# EAGLE design X2C_DC_SHIELD (EAGLE 9.0.1)
X2C Low end DC motor shield

## Sheet 1 of 2
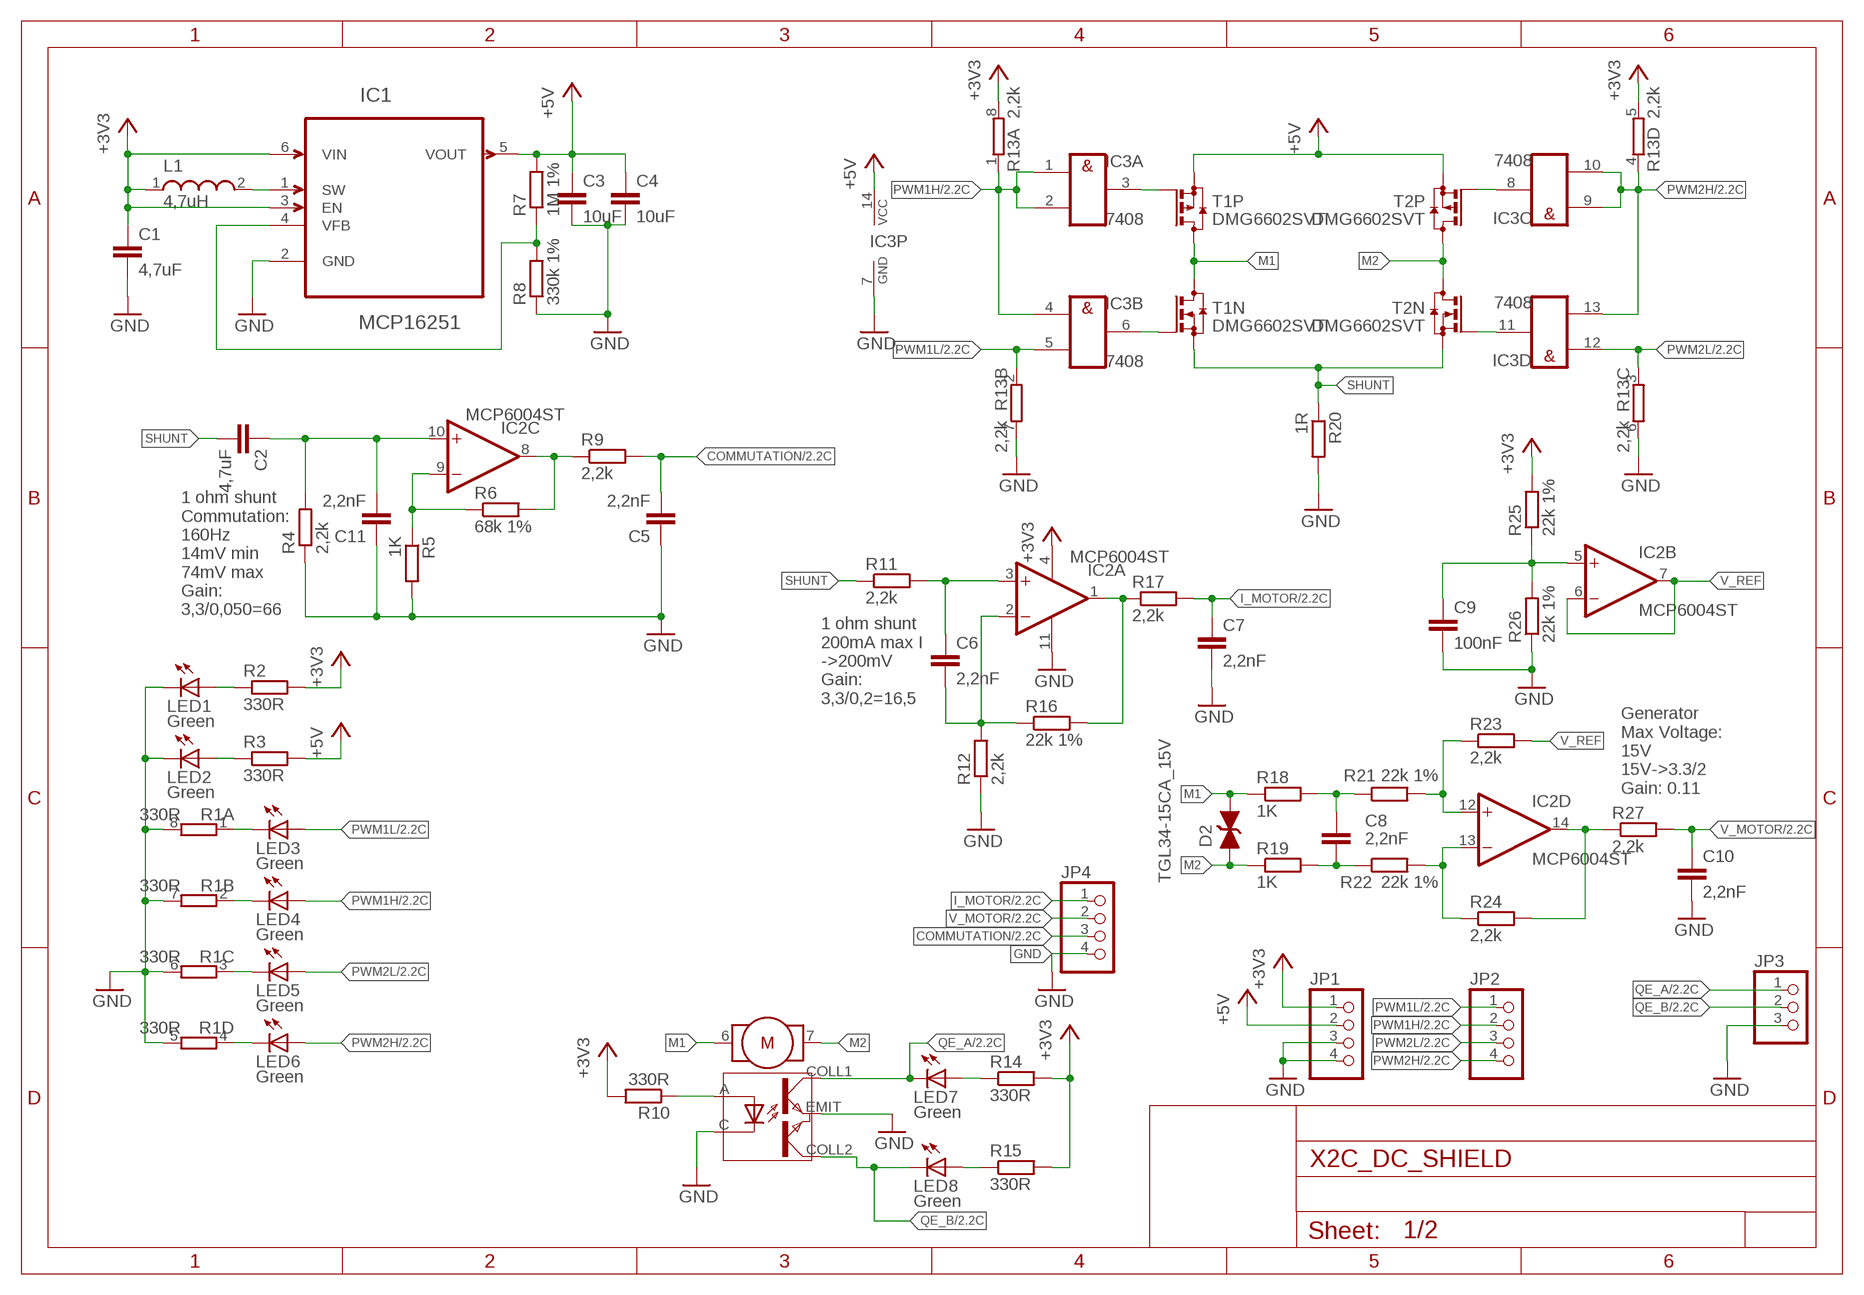
[diagram p0: schematic, sheet 1]

### Parts
C1  4,7uF  C-EU-SMD_0603_4,7UF_16V  [C0603K]
C2  4,7uF  C-EU-SMD_0603_4,7UF_16V  [C0603K]
C3  10uF  C-EU-SMD_0805_10UF_16V  [C0805K]
C4  10uF  C-EU-SMD_0805_10UF_16V  [C0805K]
C5  2,2nF  C-EU-SMD_0603_2,2NF  [C0603K]
C6  2,2nF  C-EU-SMD_0603_2,2NF  [C0603K]
C7  2,2nF  C-EU-SMD_0603_2,2NF  [C0603K]
C8  2,2nF  C-EU-SMD_0603_2,2NF  [C0603K]
C9  100nF  C-EU-SMD_0603_100NF_50V  [C0603K]
C10  2,2nF  C-EU-SMD_0603_2,2NF  [C0603K]
C11  2,2nF  C-EU-SMD_0603_2,2NF  [C0603K]
D2  TGL34-15CA_15V  TRANSIL_DUAL_DIODE  [DO213AA]
IC1  MCP16251  [SOT95P270X145-6N]
IC2  MCP6004ST  [TSSOP14]
IC3  7408  [TSSOP14]
JP1  PINHD-1X4  [1X04]
JP2  PINHD-1X4  [1X04]
JP3  PINHD-1X03_2.54  [1X03]
JP4  PINHD-1X4  [1X04]
L1  4,7uH  WE-TPC_3816_4,7UH_0,9A  [WE-TPC_3816]
LED1  Green  LEDCHIPLED_0805_GREEN  [CHIPLED_0805]
LED2  Green  LEDCHIPLED_0805_GREEN  [CHIPLED_0805]
LED3  Green  LEDCHIPLED_0805_GREEN  [CHIPLED_0805]
LED4  Green  LEDCHIPLED_0805_GREEN  [CHIPLED_0805]
LED5  Green  LEDCHIPLED_0805_GREEN  [CHIPLED_0805]
LED6  Green  LEDCHIPLED_0805_GREEN  [CHIPLED_0805]
LED7  Green  LEDCHIPLED_0805_GREEN  [CHIPLED_0805]
LED8  Green  LEDCHIPLED_0805_GREEN  [CHIPLED_0805]
MOT1  DC_MOT  DC_MOTOR_1  [DC_MOTOR]
R1  330R  4R-N330R  [EXBV8V_A]
R2  330R  R-EU_SMDR0603_330R  [R0603]
R3  330R  R-EU_SMDR0603_330R  [R0603]
R4  2,2k  R-EU_SMDR0603_2,2K  [R0603]
R5  1K  R-EU_SMDR0603_1K_1%  [R0603]
R6  68k 1%  R-EU_SMDR0603_68K_1%  [R0603]
R7  1M 1%  R-EU_SMDR0603_1M_1%  [R0603]
R8  330k 1%  R-EU_SMDR0603_330K_1%  [R0603]
R9  2,2k  R-EU_SMDR0603_2,2K  [R0603]
R10  330R  R-EU_SMDR0603_330R  [R0603]
R11  2,2k  R-EU_SMDR0603_2,2K  [R0603]
R12  2,2k  R-EU_SMDR0603_2,2K  [R0603]
R13  2,2k  4R-N2,2K  [EXBV8V_A]
R14  330R  R-EU_SMDR0603_330R  [R0603]
R15  330R  R-EU_SMDR0603_330R  [R0603]
R16  22k 1%  R-EU_SMDR0603_22K_1%  [R0603]
R17  2,2k  R-EU_SMDR0603_2,2K  [R0603]
R18  1K  R-EU_SMDR0603_1K_1%  [R0603]
R19  1K  R-EU_SMDR0603_1K_1%  [R0603]
R20  1R  R-EU_SMDR0805_1R_1%  [R0805]
R21  22k 1%  R-EU_SMDR0603_22K_1%  [R0603]
R22  22k 1%  R-EU_SMDR0603_22K_1%  [R0603]
R23  2,2k  R-EU_SMDR0603_2,2K  [R0603]
R24  2,2k  R-EU_SMDR0603_2,2K  [R0603]
R25  22k 1%  R-EU_SMDR0603_22K_1%  [R0603]
R26  22k 1%  R-EU_SMDR0603_22K_1%  [R0603]
R27  2,2k  R-EU_SMDR0603_2,2K  [R0603]
T1  DMG6602SVT  [TSOT23-6]
T2  DMG6602SVT  [TSOT23-6]

### Nets
+3V3: C1.1 IC1.3(EN) IC1.6(VIN) IC2.4(P:V+) JP1.1 L1.1 R2.2 R10.2 R13.5 R13.8 R14.2 R15.2 R25.2 ; also sheet 2
+5V: C3.1 C4.1 IC1.5(VOUT) IC3.14(P:VCC) JP1.2 R3.2 R7.2 T1.2(P:S) T2.2(P:S)
COMMUTATION: C5.2 JP4.3 R9.2 ; also sheet 2
GND: C1.2 C3.2 C4.2 C5.1 C7.2 C9.2 C10.2 C11.1 IC1.2(GND) IC2.11(P:V-) IC3.7(P:GND) JP1.3 JP1.4 JP3.3 JP4.4 LED1.C LED2.C MOT1.C MOT1.EMIT R1.5 R1.6 R1.7 R1.8 R4.1 R5.2 R8.1 R12.1 R13.6 R13.7 R20.2 R26.1 ; also sheet 2
I_MOTOR: C7.1 JP4.1 R17.2 ; also sheet 2
IMOTOR: IC2.1(A:OUT) R16.2 R17.1
M1: D2.C MOT1.6(MOT1) R18.1 T1.4(P:D) T1.6(N:D)
M2: D2.A MOT1.7(MOT2) R19.1 T2.4(P:D) T2.6(N:D)
N$1: IC3.8(C:O) T2.3(P:G)
N$2: IC3.6(B:O) T1.1(N:G)
N$3: IC3.3(A:O) T1.3(P:G)
N$4: IC1.1(SW) L1.2
N$5: C9.1 IC2.5(B:+IN) R25.1 R26.2
N$6: LED7.A R14.1
N$7: IC3.11(D:O) T2.1(N:G)
N$8: LED1.A R2.1
N$9: LED2.A R3.1
N$10: LED3.C R1.1
N$11: C6.2 IC2.2(A:-IN) R12.2 R16.1
N$12: IC1.4(VFB) R7.1 R8.2
N$13: LED4.C R1.2
N$14: LED5.C R1.3
N$15: LED6.C R1.4
N$16: LED8.A R15.1
N$18: IC2.12(D:+IN) R21.2 R23.1
N$19: C8.1 R18.2 R21.1
N$20: C8.2 R19.2 R22.1
N$21: IC2.13(D:-IN) R22.2 R24.1
N$22: C6.1 IC2.3(A:+IN) R11.2
N$23: IC2.8(C:OUT) R6.2 R9.1
N$24: IC2.9(C:-IN) R5.1 R6.1
N$25: IC2.14(D:OUT) R24.2 R27.1
N$26: C2.1 C11.2 IC2.10(C:+IN) R4.2
N$28: MOT1.A R10.1
PWM1H: IC3.1(A:I0) IC3.2(A:I1) IC3.4(B:I0) JP2.2 LED4.A R13.1 ; also sheet 2
PWM1L: IC3.5(B:I1) JP2.1 LED3.A R13.2 ; also sheet 2
PWM2H: IC3.9(C:I0) IC3.10(C:I1) IC3.13(D:I1) JP2.4 LED6.A R13.4 ; also sheet 2
PWM2L: IC3.12(D:I0) JP2.3 LED5.A R13.3 ; also sheet 2
QE_A: JP3.1 LED7.C MOT1.COLL1(COL1) ; also sheet 2
QE_B: JP3.2 LED8.C MOT1.COLL2(COL2) ; also sheet 2
SHUNT: C2.2 R11.1 R20.1 T1.5(N:S) T2.5(N:S)
V_MOTOR: C10.1 JP4.2 R27.2 ; also sheet 2
V_REF: IC2.6(B:-IN) IC2.7(B:OUT) R23.2

### Notes on the sheet
- 1 ohm shunt
  Commutation:
  160Hz
  14mV min
  74mV max
  Gain:
  3,3/0,050=66
- 1 ohm shunt
  200mA max I
  ->200mV
  Gain:
  3,3/0,2=16,5
- Generator
  Max Voltage:
  15V
  15V->3.3/2
  Gain: 0.11

## Sheet 2 of 2
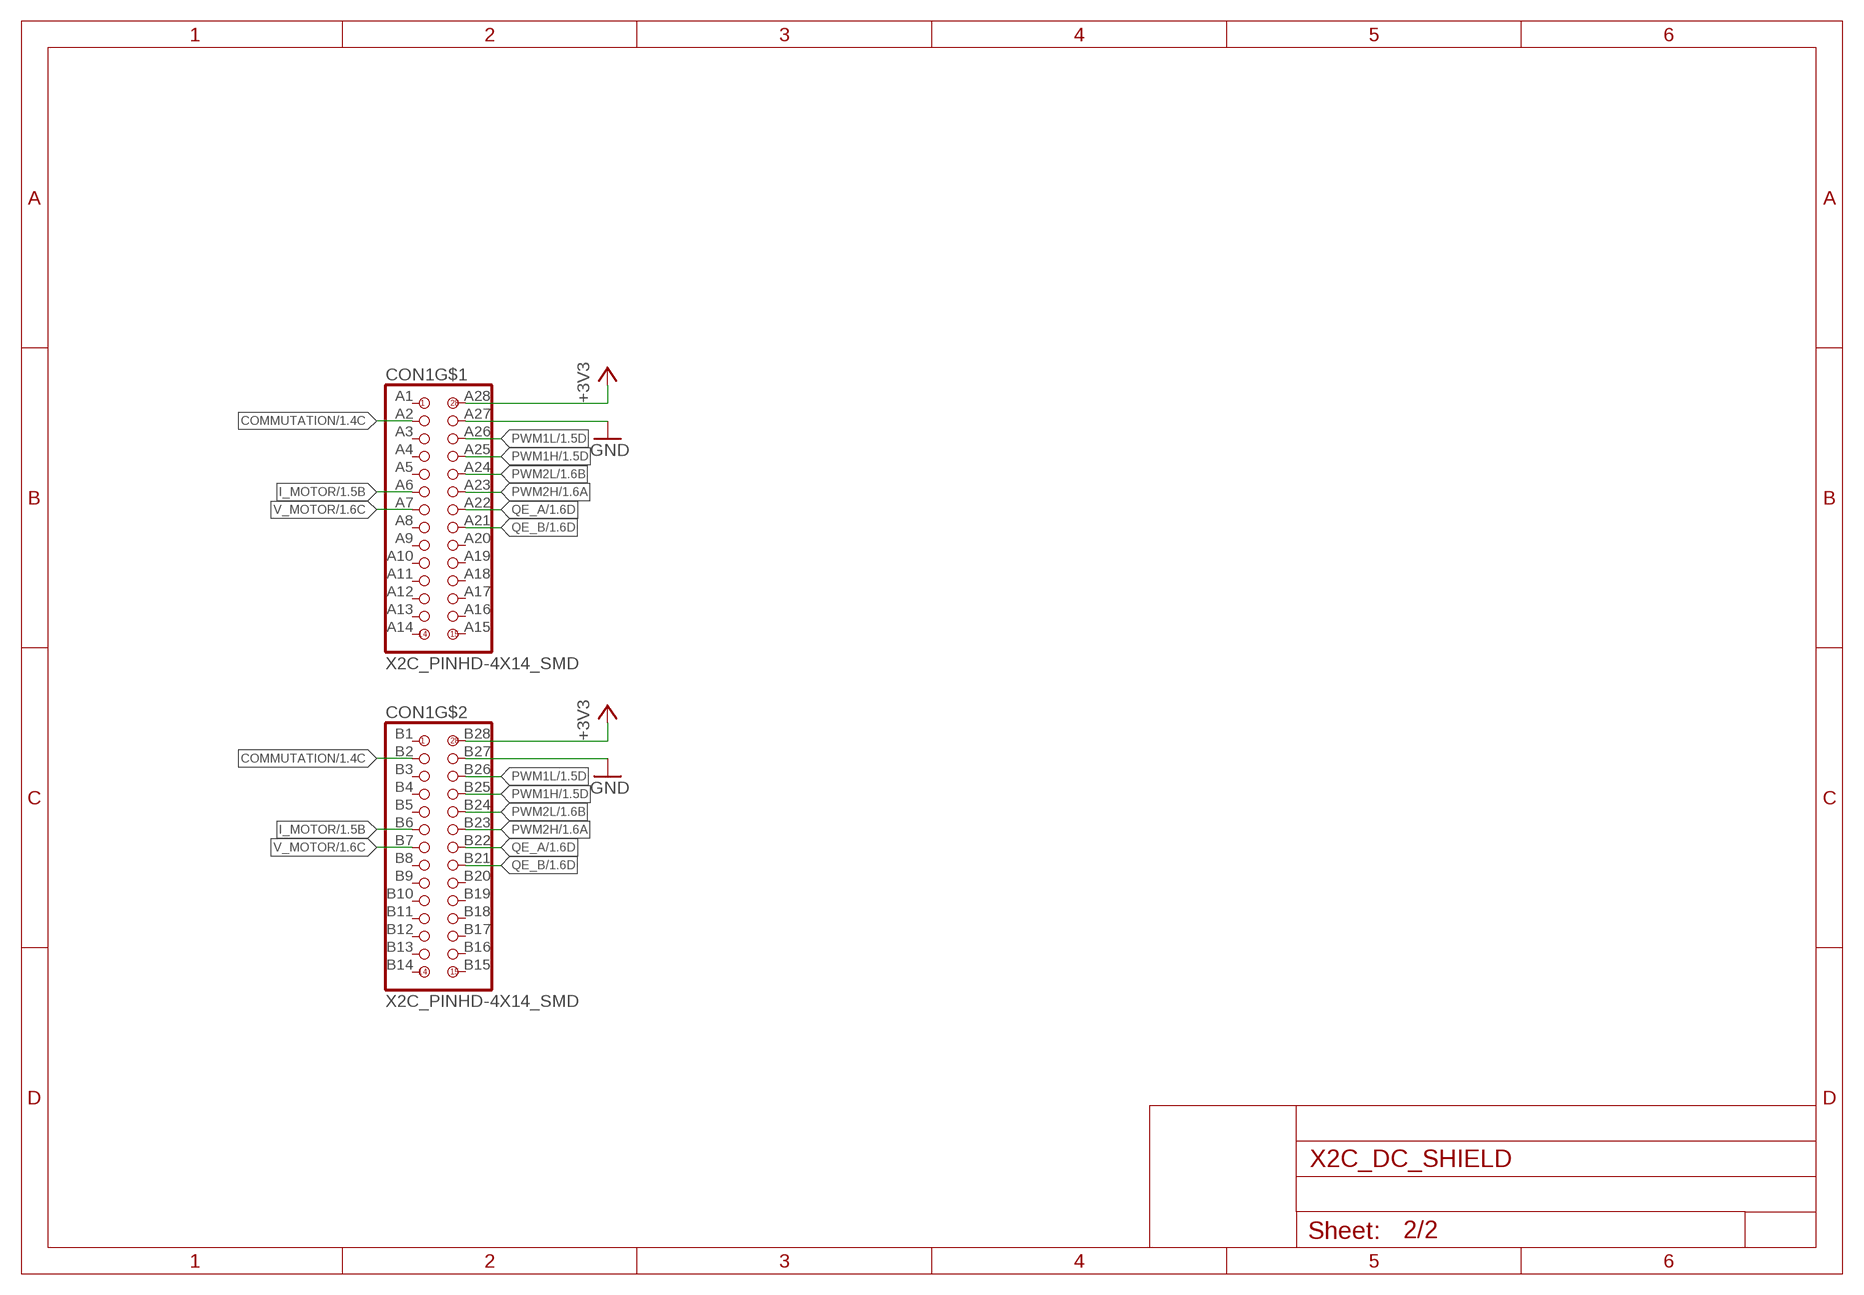
[diagram p1: schematic, sheet 2]

### Parts
CON1  X2C_PINHD-4X14_SMD  [X2C_4X14_SMD]

### Nets
+3V3: CON1.A28 CON1.B28(A28) ; also sheet 1
COMMUTATION: CON1.A2 CON1.B2(A2) ; also sheet 1
GND: CON1.A27 CON1.B27(A27) ; also sheet 1
I_MOTOR: CON1.A6 CON1.B6(A6) ; also sheet 1
PWM1H: CON1.A25 CON1.B25(A25) ; also sheet 1
PWM1L: CON1.A26 CON1.B26(A26) ; also sheet 1
PWM2H: CON1.A23 CON1.B23(A23) ; also sheet 1
PWM2L: CON1.A24 CON1.B24(A24) ; also sheet 1
QE_A: CON1.A22 CON1.B22(A22) ; also sheet 1
QE_B: CON1.A21 CON1.B21(A21) ; also sheet 1
V_MOTOR: CON1.A7 CON1.B7(A7) ; also sheet 1
Unconnected: CON1.A1 CON1.A3 CON1.A4 CON1.A5 CON1.A8 CON1.A9 CON1.A10 CON1.A11 CON1.A12 CON1.A13 CON1.A14 CON1.A15 CON1.A16 CON1.A17 CON1.A18 CON1.A19 CON1.A20 CON1.B1(A1) CON1.B3(A3) CON1.B4(A4) CON1.B5(A5) CON1.B8(A8) CON1.B9(A9) CON1.B10(A10) CON1.B11(A11) CON1.B12(A12) CON1.B13(A13) CON1.B14(A14) CON1.B15(A15) CON1.B16(A16) CON1.B17(A17) CON1.B18(A18) CON1.B19(A19) CON1.B20(A20)

## Library data of the parts
C1 C2 = KANDO_KOZOS:C-EU-SMD: CAPACITOR, European symbol; EAGLEID: 1310
C3 C4 = C_EU_Kando:C-EU-SMD: CAPACITOR, European symbol; EAGLEID: 1275
C5-C8 C10 C11 = KANDO_KOZOS:C-EU-SMD: CAPACITOR, European symbol
C9 = KANDO_KOZOS:C-EU-SMD: CAPACITOR, European symbol; EAGLEID: 1204
CON1 = KANDO_KOZOS:X2C_PINHD-4X14_SMD
D2 = KANDO_KOZOS:TRANSIL_DUAL_DIODE: Zener Diode
IC1 = KANDO_KOZOS:MCP16251: Synchronous Boost Regulator; MPN: MCP16251; OC_FARNELL: 2361974; OC_NEWARK: 12X8673; PACKAGE: SOT-23-6; SUPPLIER: Microchip
IC2 = KANDO_KOZOS:MCP6004: Quad Op Amp 2.7V to 6.0V Single Supply Source: http://www.microchip.com/wwwproducts/en/MCP6004
IC3 = KANDO_KOZOS:7408: Quad 2-input AND gate
JP1 JP2 JP4 = KANDO_KOZOS:PINHD-1X4: PIN HEADER
JP3 = KANDO_KOZOS:PINHD-1X03: PIN HEADER
L1 = KANDO_KOZOS:WE-TPC: SMD Shielded Tiny Power Inductor Characteristics Extremely flat power inductor High current capability Magnetically shielded which results in a low leakage field Operating temperature: –40 °C to +125 °C Applications Portable power like PDA, digital camera, PCMCIA cards and displays DC/DC converter Embedded PC Mobile data gathering, telemetric <http://katalog.we-online.de/media/images/eisos/IndTPC_pf2.jpg> Details see: http://katalog.we-online.de/en/pbs/WE-TPC? Updated by Dan Xu 2014-07-11 2014 (C) Wurth Elektronik
LED1-LED8 = KANDO_KOZOS:LED: LED OSRAM: - CHIPLED LG R971, LG N971, LY N971, LG Q971, LY Q971, LO R971, LY R971 LH N974, LH R974 LS Q976, LO Q976, LY Q976 LO Q996 - Hyper CHIPLED LW Q18S LB Q993, LB Q99A, LB R99A - SideLED LS A670, LO A670, LY A670, LG A670, LP A670 LB A673, LV A673, LT A673, LW A673 LH A674 LY A675 LS A676, LA A676, LO A676, LY A676, LW A676 LS A679, LY A679, LG A679 - Hyper Micro SIDELED® LS Y876, LA Y876, LO Y876, LY Y876 LT Y87S - SmartLED LW L88C, LW L88S LB L89C, LB L89S, LG L890 LS L89K, LO L89K, LY L89K LS L896, LA L896, LO L896, LY L896 - TOPLED LS T670, LO T670, LY T670, LG T670, LP T670 LSG T670, LSP T670, LSY T670, LOP T670, LYG T670 LG T671, LOG T671, LSG T671 LB T673, LV T673, LT T673, LW T673 LH T674 LS T676, LA T676, LO T676, LY T676, LB T676, LH T676, LSB T676, LW T676 LB T67C, LV T67C, LT T67C, LS T67K, LO T67K, LY T67K, LW E67C LS E67B, LA E67B, LO E67B, LY E67B, LB E67C, LV E67C, LT E67C LW T67C LS T679, LY T679, LG T679 LS T770, LO T770, LY T770, LG T770, LP T770 LB T773, LV T773, LT T773, LW T773 LH T774 LS E675, LA E675, LY E675, LS T675 LS T776, LA T776, LO T776, LY T776, LB T776 LHGB T686 LT T68C, LB T68C - Hyper Mini TOPLED® LB M676 - Mini TOPLED Santana® LG M470 LS M47K, LO M47K, LY M47K Source: http://www.osram.convergy.de LUXEON: - LUMILED® LXK2-PW12-R00, LXK2-PW12-S00, LXK2-PW14-U00, LXK2-PW14-V00 LXK2-PM12-R00, LXK2-PM12-S00, LXK2-PM14-U00 LXK2-PE12-Q00, LXK2-PE12-R00, LXK2-PE12-S00, LXK2-PE14-T00, LXK2-PE14-U00 LXK2-PB12-K00, LXK2-PB12-L00, LXK2-PB12-M00, LXK2-PB14-N00, LXK2-PB14-P00, LXK2-PB14-Q00 LXK2-PR12-L00, LXK2-PR12-M00, LXK2-PR14-Q00, LXK2-PR14-R00 LXK2-PD12-Q00, LXK2-PD12-R00, LXK2-PD12-S00 LXK2-PH12-R00, LXK2-PH12-S00 LXK2-PL12-P00, LXK2-PL12-Q00, LXK2-PL12-R00 Source: www.luxeon.com KINGBRIGHT: KA-3528ASYC Source: www.kingbright.com; EAGLEID: 1109
MOT1 = KANDO_KOZOS:DC_MOTOR
R1 = KANDO_KOZOS:4R-N: Array Chip Resistor; EAGLEID: 1025
R2 R3 R10 R14 R15 = KANDO_KOZOS:R-EU_SMD: RESISTOR, European symbol; EAGLEID: 1374
R4 R9 R11 R12 R17 R23 R24 R27 = KANDO_KOZOS:R-EU_SMD: RESISTOR, European symbol; EAGLEID: 1364
R5 R7 R8 R18-R20 = KANDO_KOZOS:R-EU_SMD: RESISTOR, European symbol
R6 = KANDO_KOZOS:R-EU_SMD: RESISTOR, European symbol; EAGLEID: 1324
R13 = KANDO_KOZOS:4R-N: Array Chip Resistor; EAGLEID: 1022
R16 R21 R22 R25 R26 = KANDO_KOZOS:R-EU_SMD: RESISTOR, European symbol; EAGLEID: 1314
T1 T2 = KANDO_KOZOS:DMG6602SVT; EAGLEID: 1334

## Board
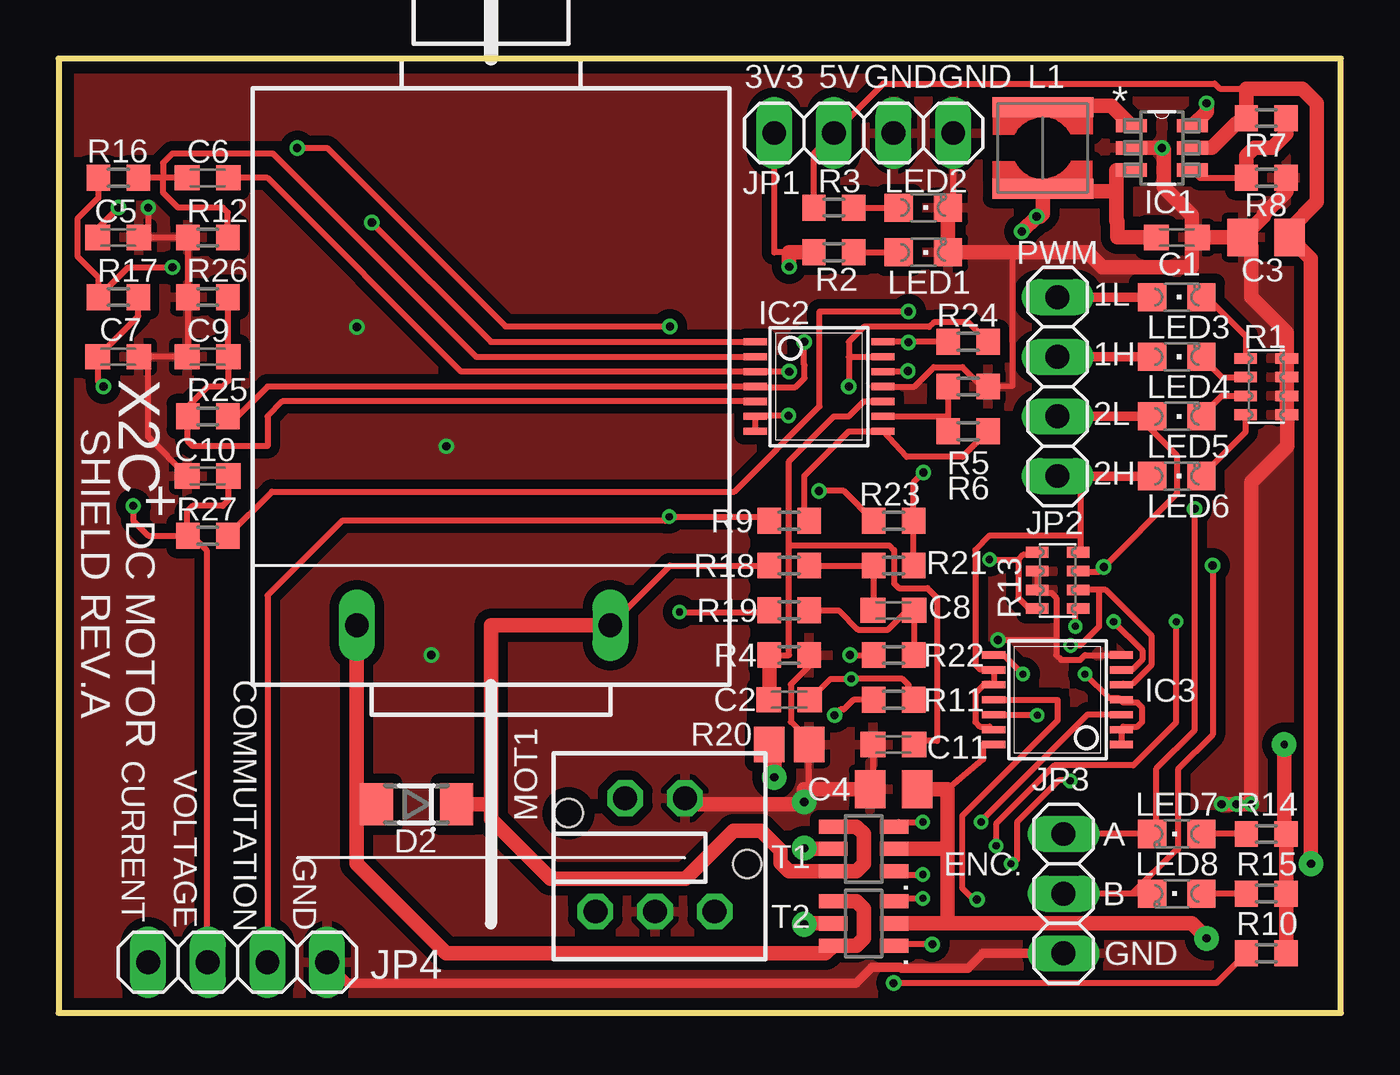
[diagram p2: board, top side]
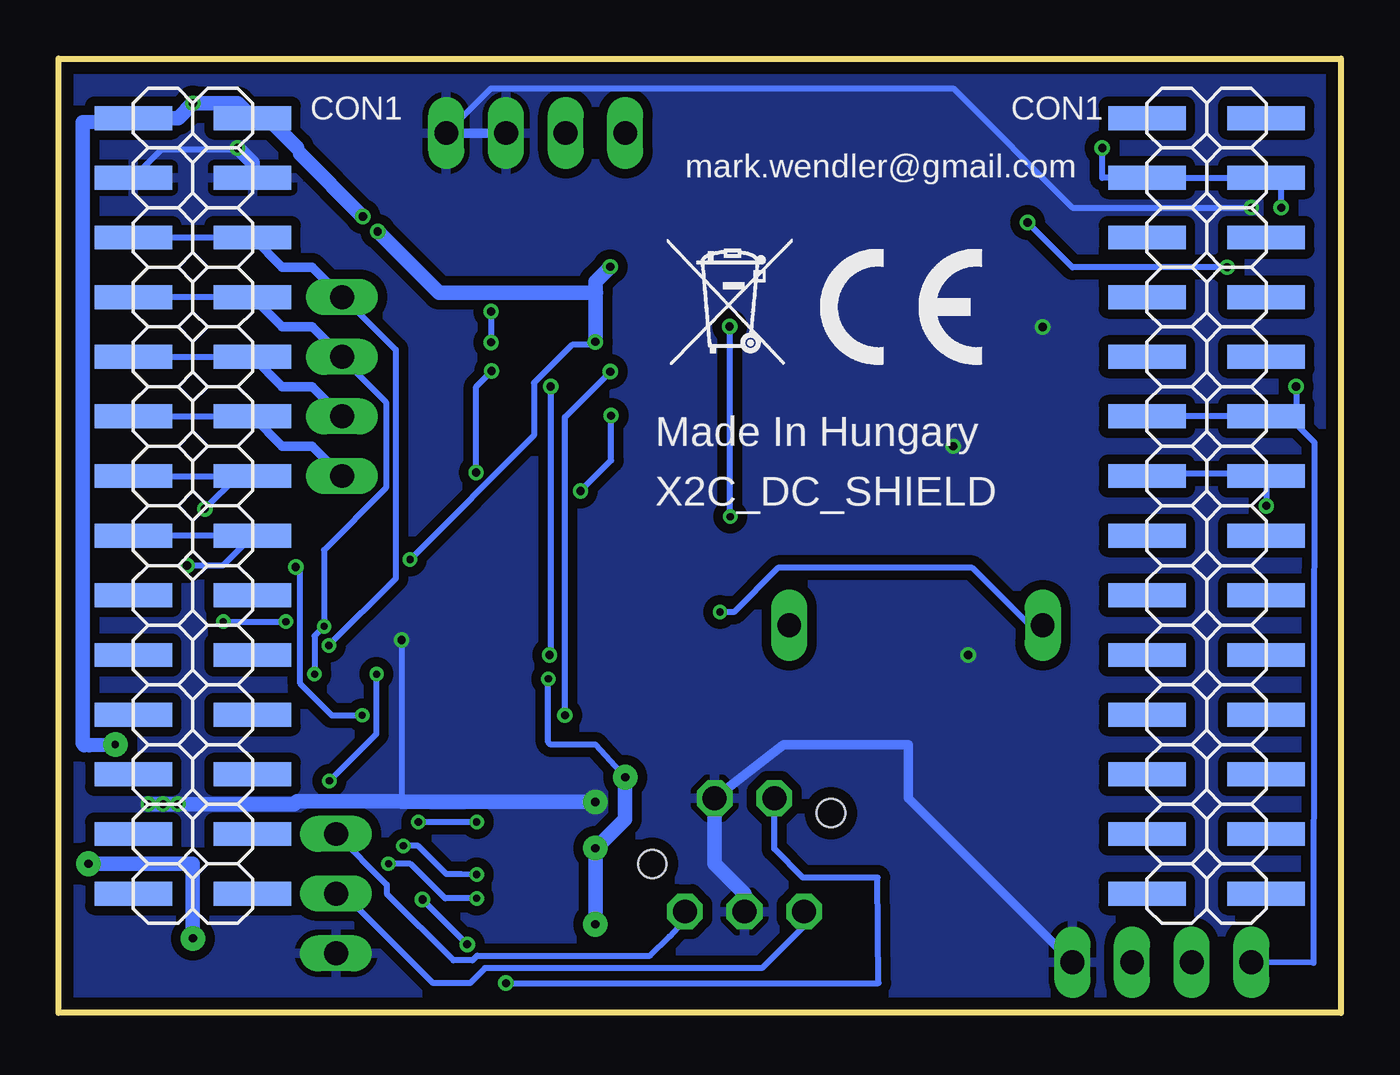
[diagram p3: board, bottom side, seen from below]

Size 54.61 x 40.63 mm. Coordinates in mm from the lower left corner, seen from the top.
Outline: 0,0 54.61,0 54.61,40.63 0,40.63 0,0
Copper layers (1*16): Top 0.035mm / dielectric 1.6mm / Bottom 0.035mm
Design rules "Elecrow_2-layer_PCB_eagle_rule": minimum track width 6mil, minimum drill 12mil, track to track 6mil, track to pad 6mil, pad to pad 6mil, via to via 8mil, smd to smd 0mil, copper to edge 20mil, drill to drill 10mil, minimum pad ring 6mil, minimum via ring 6mil, stop-mask expansion 0mil, vias tented up to drill 100mil, thermal gap 10mil

### Footprints (pad centres in the part's own frame; a part is rotated, then mirrored left to right if it is on the bottom)
C0603K = smd 1.05 x 1.08: 1 -0.875,0; 2 0.875,0
C0805K = smd 1.3 x 1.6: 1 -1,0; 2 1,0
X2C_4X14_SMD = smd 1.016 x 3.302: A1 -16.51,44.45; A2 -13.97,44.45; A3 -11.43,44.45; A4 -8.89,44.45; A5 -6.35,44.45; A6 -3.81,44.45; A7 -1.27,44.45; A8 1.27,44.45; A9 3.81,44.45; A10 6.35,44.45; A11 8.89,44.45; A12 11.43,44.45; A13 13.97,44.45; A14 16.51,44.45; A15 16.51,1.27; A16 13.97,1.27; A17 11.43,1.27; A18 8.89,1.27; A19 6.35,1.27; A20 3.81,1.27; A21 1.27,1.27; A22 -1.27,1.27; A23 -3.81,1.27; A24 -6.35,1.27; A25 -8.89,1.27; A26 -11.43,1.27; A27 -13.97,1.27; A28 -16.51,1.27; B1 -16.51,39.37; B2 -13.97,39.37; B3 -11.43,39.37; B4 -8.89,39.37; B5 -6.35,39.37; B6 -3.81,39.37; B7 -1.27,39.37; B8 1.27,39.37; B9 3.81,39.37; B10 6.35,39.37; B11 8.89,39.37; B12 11.43,39.37; B13 13.97,39.37; B14 16.51,39.37; B15 16.51,-3.81; B16 13.97,-3.81; B17 11.43,-3.81; B18 8.89,-3.81; B19 6.35,-3.81; B20 3.81,-3.81; B21 1.27,-3.81; B22 -1.27,-3.81; B23 -3.81,-3.81; B24 -6.35,-3.81; B25 -8.89,-3.81; B26 -11.43,-3.81; B27 -13.97,-3.81; B28 -16.51,-3.81
DO213AA = smd 1.4 x 1.8: A 1.7,0; C -1.7,0
SOT95P270X145-6N = smd 1.321 x 0.559: 1 -1.295,0.94; 2 -1.295,0; 3 -1.295,-0.94; 4 1.295,-0.94; 5 1.295,0; 6 1.295,0.94
TSSOP14 = smd 0.305 x 0.991: 1 -1.905,-2.718; 2 -1.27,-2.718; 3 -0.635,-2.718; 4 0,-2.718; 5 0.635,-2.718; 6 1.27,-2.718; 7 1.905,-2.718; 8 1.905,2.718; 9 1.27,2.718; 10 0.635,2.718; 11 0,2.718; 12 -0.635,2.718; 13 -1.27,2.718; 14 -1.905,2.718
1X04 = drill 1.016 long: 1 -3.81,0; 2 -1.27,0; 3 1.27,0; 4 3.81,0
1X03 = drill 1.016 long: 1 -2.54,0; 2 0,0; 3 2.54,0
WE-TPC_3816 = smd 0.85 x 4.3: 1 -1.731,0; 2 1.731,0
CHIPLED_0805 = smd 1.2 x 1.2: A 0,-1.05; C 0,1.05
DC_MOTOR = drill 1.016 long: 6 -5.08,0; 7 5.715,0 | drill 1.016 octagon: A -5.715,7.366; C -8.255,7.366; COLL1 -9.525,12.192; COLL2 -4.445,12.192; EMIT -6.985,12.192 | hole 1.2: -10.922,10.16; -3.302,8.001
EXBV8V_A = smd 0.45 x 0.965: 1 -1.2,-0.876; 2 -0.4,-0.876; 3 0.4,-0.876; 4 1.2,-0.876; 5 1.2,0.876; 6 0.4,0.876; 7 -0.4,0.876; 8 -1.2,0.876
R0603 = smd 1 x 1.1: 1 -0.85,0; 2 0.85,0
R0805 = smd 1.3 x 1.5: 1 -0.85,0; 2 0.85,0
TSOT23-6 = smd 0.6 x 1.2: 1 -0.95,-1.3; 2 0,-1.3; 3 0.95,-1.3; 4 0.95,1.3; 5 0,1.3; 6 -0.95,1.3

### Placement (x,y rotation side)
C1  47.62,33.02 0 top
C2  31.11,13.34 0 top
C3  51.44,33.02 180 top
C4  35.56,9.53 180 top
C5  2.54,33.02 180 top
C6  6.35,35.56 180 top
C7  2.54,27.94 0 top
C8  35.56,17.14 0 top
C9  6.35,27.94 180 top
C10  6.35,22.86 180 top
C11  35.56,11.43 0 top
CON1  47.62,21.59 270 bottom
D2  15.24,8.89 180 top
IC1  46.99,36.83 0 top
IC2  32.38,26.67 270 top
IC3  42.55,13.34 90 top
JP1  34.29,37.47 0 top
JP2  42.55,26.67 270 top
JP3  42.8,5.08 270 top
JP4  7.62,2.16 0 top
L1  41.91,36.83 90 top
LED1  36.83,32.38 270 top
LED2  36.83,34.29 270 top
LED3  47.62,30.48 270 top
LED4  47.62,27.94 270 top
LED5  47.62,25.4 270 top
LED6  47.62,22.86 270 top
LED7  47.62,7.62 90 top
LED8  47.62,5.08 90 top
MOT1  18.41,16.51 180 top
R1  51.44,26.67 270 top
R2  33.02,32.38 180 top
R3  33.02,34.29 180 top
R4  31.11,15.24 180 top
R5  38.73,26.67 0 top
R6  38.73,24.77 0 top
R7  51.44,38.1 180 top
R8  51.44,35.56 180 top
R9  31.11,20.95 180 top
R10  51.44,2.54 0 top
R11  35.56,13.34 180 top
R12  6.35,33.02 0 top
R13  42.55,18.41 90 top
R14  51.44,7.62 0 top
R15  51.44,5.08 0 top
R16  2.54,35.56 180 top
R17  2.54,30.48 0 top
R18  31.11,19.05 0 top
R19  31.11,17.14 0 top
R20  31.11,11.43 0 top
R21  35.56,19.05 0 top
R22  35.56,15.24 180 top
R23  35.56,20.95 180 top
R24  38.73,28.57 180 top
R25  6.35,25.4 0 top
R26  6.35,30.48 0 top
R27  6.35,20.32 180 top
T1  34.29,6.99 90 top
T2  34.29,3.81 90 top
U$1  [CE_KUKA+MADE+NAME]  15.24,21.59 0 top

### Tracks (layer width: path | path; a pad name or v marks a point on that pad's centre or on a via)
+3V3  (via drill 0.3, 0.3 pad 1.05, 0.35)
  Top 0.254: 31.11,32.38 30.48,32.38 JP1.1 | v31.75,28.57 31.75,27.6 31.77,27.58 31.77,27.03 31.39,26.65 30.1,26.65 30.07,26.67 IC2.4 8.89,26.67 7.62,25.4 R25.2 | 40.87,19.3 40.87,17.68 41.27,17.27 41.48,17.27 R13.8 | 40.87,19.3 41.07,19.51 41.48,19.51 R13.5 | v39.65,19.3 40.87,19.3 | 52.45,7.72 R14.2 | L1.1 41.88,35.15 42.06,35.02
  Top 0.61: IC1.6 48.9,38.38 v48.9,38.73 | 42.25,35.02 42.17,34.98 42.06,35.02 41.94,35.02 | 45.1,35.89 IC1.3 45.05,35.89 45.05,34.92 | R2.2 31.11,32.38 v31.11,31.77 | C1.1 45.09,33.02 45.09,33.7 45.05,33.74 45.05,34.92 | R14.2 R15.2 R10.2 | v52.2,11.43 52.2,7.62 52.3,7.72 52.45,7.72 | L1.1 41.91,35.05 | 41.91,35.05 41.91,34.04 41.78,33.91 v41.66,33.91 v41.02,33.27 | 41.94,35.02 41.91,35.05 | 45.05,34.92 44.99,34.98 41.97,34.98 41.94,35.02
  Bottom 0.254: 31.75,31.14 31.66,31.23 31.73,30.66 | v39.65,19.3 34.37,24.59 34.37,26.82 32.74,28.45 31.93,28.45 v31.75,28.57 | 53.52,11.4 53.31,11.4 | 51.64,38 CON1.B28 | 44.32,36.58 44.45,36.83
  Bottom 0.61: 44.45,36.83 45.72,38.1 CON1.A28 46.99,38.73 v48.9,38.73 49.53,38.1 CON1.B28 | v31.75,28.57 31.75,31.14 | 31.66,31.23 v31.11,31.77 | 53.31,11.4 v52.2,11.43 | 53.52,11.4 53.59,11.47 53.59,37.92 51.64,38 | 31.73,30.66 38.41,30.66 v41.02,33.27 | 44.32,36.58 v41.66,33.91
+5V  (via drill 0.35 pad 1.05)
  Top 0.254: R3.2 32.17,36.62 JP1.2 35.12,39.57 49.24,39.57 49.45,39.36 50.58,39.36 | IC3.14 39.37,11.43 39.37,10.79 37.85,9.53
  Top 0.61: IC1.5 49.11,36.83 50.16,37.88 R7.2 50.58,39.36 52.97,39.36 53.59,38.74 53.59,34.53 52.44,33.38 C3.1 53.34,32.12 v53.34,6.35 | T2.2 37.85,3.81 | 37.85,3.81 37.85,6.99 | 37.85,6.99 T1.2 | C4.1 37.85,9.53 37.85,6.99 | v48.9,3.17 48.26,3.81 37.85,3.81
  Bottom 0.61: 53.34,6.36 v53.34,6.35 48.9,6.35 v48.9,3.17
COMMUTATION  (via drill 0.3, 0.35)
  Top 0.254: C5.2 1.67,33.41 v2.54,34.29 | v26.04,29.23 19.03,29.23 11.43,36.83 v10.16,36.83 | R9.2 30.07,21.13 v26.01,21.13 25.83,20.95 12.06,20.95 8.89,17.78 JP4.3
  Bottom 0.254: v2.54,34.29 2.54,35.56 CON1.A2 CON1.B2 10.16,35.56 v10.16,36.83 | v26.04,29.23 26.04,21.13 | 26.04,21.13 26.04,20.95 | v26.01,21.13 26.04,21.13 | 8.94,2.23 JP4.3
GND  (via drill 0.35, 0.35 pad 1.05)
  Top 0.254: 3.81,27.94 C9.2 5.5,27.96 R26.1 R12.1 3.81,33.02 | 3.81,27.94 C7.2 | R4.1 31.96,14.77 31.19,13.99 31.19,12.39 31.75,11.83 31.75,11.44 | 40.64,32.38 40.64,26.71 R5.2 39.33,26.67 38.5,27.5 37.27,27.5 36.44,26.67 IC2.11 | C10.2 3.81,24.52 3.81,27.94 | R13.6 41.68,18.69 41.68,18.09 R13.7 41.68,17.88 42.29,17.88 42.49,17.68 42.49,15.88 | IC3.7 43.71,15.24 43.51,15.04 42.7,15.04 42.49,15.24 42.49,15.88 | 31.75,11.44 31.93,11.58 R20.2 31.96,9.74 31.75,9.53 | 31.75,11.44 31.75,11.43 | 42.49,15.88 v40.01,15.88 | C5.1 3.81,33.02 | v3.81,34.29 3.81,33.02 | LED2.C 37.88,34.51 38.1,34.29 JP1.4 | C11.1 34.69,9.65 C4.2
  Top 0.406: JP3.3 39.37,2.54 38.73,1.91 35.89,1.91 35.84,1.95 34.64,1.95 33.96,1.27 12.32,1.27 JP4.4
  Top 0.61: IC1.2 v46.99,36.83 47.07,36.78 47.07,35.17 48.26,33.97 48.26,33.02 C1.2 | LED2.C LED1.C 40.64,32.38 43.81,32.38 44.45,31.75 48.26,31.75 48.26,32.78 C1.2 | C3.2 C1.2 | C3.2 51.33,33.91 51.33,34.01 52.28,34.97 R8.1 | C3.2 50.8,32.66 50.8,30.48 52.31,28.97 R1.8 R1.7 R1.6 R1.5 52.32,25.46 52.32,24.13 50.8,22.61 v50.8,8.89 | C4.2 31.75,9.53 v31.75,8.98 31.75,8.89 27.3,8.89 27.05,9.14 MOT1.C | v50.8,8.89 v50.16,8.89 v49.53,8.89 v50.8,8.89 | v50.8,8.89 50.83,8.92
  Bottom 0.254: CON1.B27 50.22,36.78 47.17,36.78 v46.99,36.83 | v40.01,15.88 40.01,8.98 | JP1.4 36.2,39.37 16.51,39.37 11.43,34.29 v3.81,34.29
  Bottom 0.406: JP1.3 JP1.4 | JP4.4 18.41,9.14 18.41,11.43 23.75,11.43 MOT1.C
  Bottom 0.61: CON1.A27 46.35,36.2 v46.99,36.83 | v31.75,8.98 40.01,8.98 40.01,9.02 44.45,9.02 44.58,8.89 v49.53,8.89 v50.8,8.89 v50.16,8.89 | MOT1.C 26.67,6.35 25.4,5.08 MOT1.EMIT
  other vias: 12.7,29.21 16.51,24.13 15.88,15.24
  pour Bottom (isolate 0.406): 0,0 0,40.64 54.61,40.64 54.61,0
  pour Top (isolate 0.406): 0,0 0,40.64 54.61,40.64 54.61,0
I_MOTOR  (via drill 0.35)
  Top 0.254: v1.91,26.67 1.67,26.91 C7.1 3.39,29.66 R17.2
  Bottom 0.254: v1.91,26.67 1.91,25.4 | CON1.B6 CON1.A6 1.91,25.4 | JP4.1 1.17,2.13 1.17,2.91 1.13,24.28 1.12,24.28 1.91,25.07 1.91,25.4
IMOTOR  (via drill 0.35)
  Top 0.254: R16.2 1.69,34.71 0.79,33.81 0.79,32.23 1.69,31.33 R17.1 2.96,31.75 v4.84,31.75 | v13.34,33.66 18.41,28.57 IC2.1
  Bottom 0.254: v4.84,31.75 11.43,31.75 v13.34,33.66
M1
  Top 0.254: MOT1.6 26.04,19.05 R18.1
  Top 0.61: D2.C 18.41,8.89 | 18.41,8.89 18.41,16.51 MOT1.6 | T1.4 33.98,7.93 34.29,7.62 34.29,6.35 33.98,6.04 T1.6 31.11,6.04 30.75,6.4 30.75,6.93 29.92,7.76 28.75,7.76 26.7,5.71 20.95,5.71 18.41,8.26 18.41,8.89
M2  (via drill 0.3)
  Top 0.254: v26.44,17.07 30.1,17.07 R19.1
  Top 0.61: 12.7,8.81 D2.A 12.7,8.84 | 12.7,8.84 MOT1.7 | T2.4 33.98,4.76 34.29,4.45 34.29,3.17 33.98,2.86 T2.6 32.67,2.54 16.51,2.54 12.7,6.35 12.7,8.81 | 12.7,8.81 12.7,8.84
  Bottom 0.254: v26.44,17.07 25.86,17.07 23.98,18.95 15.7,18.95 12.8,16.05 MOT1.7
N$1  (via drill 0.3)
  Top 0.254: IC3.8 40.26,15.24 v41.07,14.43 | v36.8,4.88 35.79,4.88 T2.3 | v43.08,9.88 42.93,9.91 42.6,9.91 40.82,8.13 40.82,6.53 40.64,6.35 v40.56,6.35
  Bottom 0.254: v41.07,14.43 41.07,11.89 v43.08,9.88 | v36.8,4.88 38.15,4.88 39.62,6.35 v40.56,6.35 | v40.56,6.35 40.64,6.35 40.56,6.27 v40.56,6.35
N$2  (via drill 0.3)
  Top 0.254: v44.93,16.66 46.15,15.44 46.15,15.04 45.74,14.63 45.34,14.63 IC3.6 | v47.6,16.66 47.6,12.37 45.77,10.54 42.42,10.54 39.93,8.05 v39.93,7.11 | v36.8,5.89 35.79,5.89 T1.1
  Bottom 0.254: v47.6,16.66 v44.93,16.66 | v36.8,5.89 37.46,5.91 | 37.46,5.91 38.1,5.92 arc-90 38.09,5.91 | 37.46,5.91 38.09,5.91 | v39.93,7.11 39.29,7.11 38.09,5.91
N$3  (via drill 0.3)
  Top 0.254: v36.8,8.13 35.79,8.13 T1.3 | IC3.3 43.81,12.7 39.29,8.18 v39.29,8.13
  Bottom 0.254: v36.8,8.13 v39.29,8.13
N$4
  Top 0.254: 42.21,38.64 42.09,38.61 L1.2
  Top 0.61: 41.91,38.61 41.94,38.64 42.02,38.64 42.1,38.68 42.21,38.64 44.83,38.64 IC1.1
N$5
  Top 0.254: 7.2,27.91 C9.1 | C9.1 7.22,30.45 R26.2 | IC2.5 9.53,26.04 8.89,25.4 8.89,24.13 5.71,24.13 5.5,24.34 R25.1 5.5,25.82 6.35,26.67 6.99,26.67 7.22,26.91 C9.1
N$6
  Top 0.254: R14.1 LED7.A
N$7  (via drill 0.35)
  Top 0.254: IC3.11 42.55,13.34 42.55,12.45 38.48,8.38 38.48,5.33 38.99,4.83 v39.12,4.83 | v37.21,2.92 35.65,2.92 T2.1
  Bottom 0.254: v39.12,4.83 v37.21,2.92
N$8
  Top 0.254: R2.1 LED1.A
N$9
  Top 0.254: R3.1 LED2.A
N$10
  Top 0.254: LED3.C 48.9,30.48 50.56,28.82 R1.1
N$11
  Top 0.254: 7.22,33.05 R12.2 | R12.2 6.95,33.02 | IC2.2 17.78,27.94 9.12,36.6 4.85,36.6 4.45,36.2 4.45,35.56 | 4.45,35.56 4.45,34.92 5.08,34.29 6.99,34.29 7.2,34.08 R12.2 | 4.45,35.56 R16.1 | C6.2 4.45,35.56
N$12
  Top 0.254: IC1.4 48.62,35.56 R8.2
  Top 0.61: R7.1 52.28,37.43 51.69,36.83 50.93,36.83 50.59,36.49 R8.2
N$13
  Top 0.254: LED4.C 49.55,27.07 R1.2
N$14
  Top 0.254: LED5.C 49.55,26.27 R1.3
N$15
  Top 0.254: LED6.C 50.56,24.74 R1.4
N$16
  Top 0.254: R15.1 LED8.A
N$18  (via drill 0.35)
  Top 0.254: R21.2 R23.1 36.41,22.59 v36.83,23.02 | v36.17,27.33 36.15,27.3 IC2.12
  Bottom 0.254: v36.83,23.02 36.83,26.67 v36.17,27.33
N$19
  Top 0.254: C8.1 34.71,17.17 R21.1 R18.2
N$20
  Top 0.254: R22.1 36.44,15.27 C8.2 36.15,17.14 35.33,16.33 34.04,16.33 33.23,17.14 R19.2
N$21  (via drill 0.35)
  Top 0.254: R24.1 38.76,29.4 37.27,29.4 37.08,29.21 34.29,29.21 33.66,28.57 33.66,27.94 | 33.66,27.94 IC2.13 | 33.66,27.94 v33.66,26.67 | v33.7,15.24 R22.2
  Bottom 0.254: v33.66,26.67 33.66,15.29 v33.7,15.24
N$22  (via drill 0.35)
  Top 0.254: v33.05,12.68 33.3,12.93 33.44,12.93 33.85,13.34 R11.2 | v31.11,27.3 IC2.3 17.14,27.3 8.89,35.56 C6.1
  Bottom 0.254: v33.05,12.68 33.05,25.37 v31.11,27.3
N$23
  Top 0.254: R6.2 38.49,23.67 36.12,23.67 IC2.8 33.66,24.77 31.75,22.86 31.75,21.21 31.73,21.19 R9.1
N$24
  Top 0.254: R5.1 37.88,25.4 | 37.88,25.4 R6.1 | IC2.9 37.88,25.4
N$25  (via drill 0.35)
  Top 0.254: R24.2 36.2,28.57 | 36.2,28.57 IC2.14 | R27.1 9.08,22.2 28.78,22.2 32.41,25.83 32.41,29.87 v36.2,29.87 | v36.2,28.55 36.2,28.57
  Bottom 0.254: v36.2,29.87 v36.2,28.55
N$26
  Top 0.254: R4.2 31.11,15.24 31.11,19.91 | IC2.10 34.29,26.04 33.66,25.4 33.02,25.4 31.11,23.5 31.11,19.91 | 31.11,19.91 35.38,19.91 35.59,19.71 35.59,18.29 35.79,18.09 37.01,18.09 37.41,17.68 37.41,11.58 36.59,11.58 C11.2
  Top 0.61: 30.24,13.45 C2.1 30.27,13.36 R4.2
N$28  (via drill 0.35)
  Top 0.254: R10.1 49.31,1.27 v35.56,1.27
  Bottom 0.254: v35.56,1.27 19.68,1.27 19.74,5.77 22.91,5.77 24.13,6.99 MOT1.A
PWM1H  (via drill 0.3)
  Top 0.254: IC3.1 IC3.2 45.34,12.19 45.95,12.19 46.15,12.39 46.15,13.01 45.95,13.21 45.34,13.21 IC3.4 45.14,13.41 44.73,13.41 v43.71,14.43 | v43.31,16.46 43.31,17.07 R13.1
  Top 0.406: JP2.2 LED4.A
  Bottom 0.254: CON1.A25 CON1.B25 | JP2.2 42.49,27.84 40.66,26.01 40.66,22.35 43.31,19.71 v43.31,16.46 43.71,16.05 v43.71,14.43
  Bottom 0.406: CON1.A25 45.09,29.21 43.81,29.21 JP2.2
PWM1L  (via drill 0.3)
  Top 0.254: 44.32,18.01 44.6,18.01 46.56,16.05 46.56,14.83 45.74,14.02 45.34,14.02 IC3.5 | 44.32,18.01 43.76,18.01 R13.2 | 44.32,18.01 44.32,16.46 43.51,15.65 v43.1,15.65
  Top 0.406: JP2.1 LED3.A
  Bottom 0.254: CON1.B26 CON1.A26 | v43.1,15.65 40.26,18.49 40.26,28.25 42.49,30.48 JP2.1
  Bottom 0.406: CON1.A26 45.09,31.75 43.81,31.75 JP2.1
PWM2H
  Top 0.254: IC3.13 39.65,12.19 39.24,12.19 39.04,12.39 39.04,13.61 39.45,14.02 39.65,14.02 IC3.10 39.85,14.02 39.85,14.63 IC3.9 39.65,14.63 39.24,14.63 39.04,14.83 39.04,19.71 39.65,20.32 43.51,20.32 | 43.51,20.32 43.51,22.76 JP2.4 | 43.51,20.32 43.51,19.71 R13.4
  Top 0.406: JP2.4 LED6.A
  Bottom 0.254: CON1.B23 CON1.A23
  Bottom 0.406: CON1.A23 45.09,24.13 43.81,24.13 JP2.4
PWM2L  (via drill 0.3, 0.35)
  Top 0.254: 45.97,25.4 47.62,23.75 47.62,22.1 v44.51,18.99 44.3,18.77 43.89,18.77 R13.3 | v41.68,12.68 39.98,12.68 IC3.12
  Top 0.406: JP2.3 45.97,25.4 LED5.A
  Bottom 0.254: CON1.A24 CON1.B24 51.44,28.04 | v41.68,12.68 42.98,12.68 44.32,14.02 44.32,18.92 v44.51,18.99
  Bottom 0.406: CON1.A24 45.09,26.67 43.81,26.67 JP2.3
QE_A  (via drill 0.35)
  Top 0.254: v48.39,21.46 48.39,12.04 46.75,10.41 46.75,7.8 LED7.C JP3.1
  Bottom 0.254: CON1.B22 46.99,22.86 | v48.39,21.46 46.99,22.86 | 46.99,22.86 CON1.A22 | MOT1.COLL1 28.02,3.89 28.6,3.25 29.41,2.44 36.78,2.44 36.98,2.23 37.8,2.23 40.64,5.08 40.64,5.46 JP3.1
QE_B  (via drill 0.35)
  Top 0.254: v49.15,19.05 49.15,11.85 47.67,10.37 47.67,6.94 47.58,6.94 45.72,5.08 | LED8.C 45.72,5.08 | 45.72,5.08 JP3.2
  Bottom 0.254: CON1.B21 CON1.A21 47.62,19.05 v49.15,19.05 | MOT1.COLL2 22.94,4.52 22.68,3.89 24.66,1.91 36.45,1.91 37.08,1.27 38.66,1.27 42.47,5.08 JP3.2
SHUNT  (via drill 0.3, 0.35 pad 1.05)
  Top 0.254: R11.1 36.2,13.55 36.2,13.97 35.94,14.22 v33.76,14.22 32.88,14.22 C2.2
  Top 0.61: v30.48,10.03 30.48,11.21 R20.1 | T2.5 31.78,3.81 | 31.78,3.81 v31.75,3.78 | 31.75,3.84 31.78,3.81 | v31.75,7.02 31.78,6.99 T1.5
  Bottom 0.254: 30.71,9.86 v30.48,10.03 31.75,11.43 33.66,11.43 33.76,11.53 v33.76,14.22
  Bottom 0.61: 31.75,6.99 30.48,8.26 v30.48,10.03 | 31.75,6.99 v31.75,3.78 | v31.75,7.02 31.75,6.99
V_MOTOR  (via drill 0.35)
  Top 0.254: 6.99,22.62 C10.1 7.22,21.83 6.99,21.59 5.71,21.59 5.46,21.34 5.46,20.36 R27.2 | 5.71,20.32 5.69,20.32 | v3.17,21.59 3.17,20.95 3.81,20.32 R27.2 | 5.69,20.32 6.3,19.71 6.3,2.23 JP4.2 | 5.69,20.32 R27.2
  Bottom 0.254: v3.17,21.59 CON1.A7 3.25,22.96 8.13,22.96 CON1.B7
V_REF  (via drill 0.35)
  Top 0.254: IC2.7 IC2.6 29.7,25.43 v31.08,25.43 | R23.2 33.44,22.23 v32.38,22.23
  Bottom 0.254: v32.38,22.23 31.08,23.53 v31.08,25.43

### Text on the board
tPlace: 3V3 | 5V | GND | GND | PWM | 1L | 1H | X2C | DC MOTOR / SHIELD REV.A | 2L | + | 2H | COMMUTATION | A | CURRENT | VOLTAGE | ENC. | GND | B | GND
bPlace: mark.wendler@gmail.com